# Altium schematic sheet Ampli_FI2.SchDoc
size A4
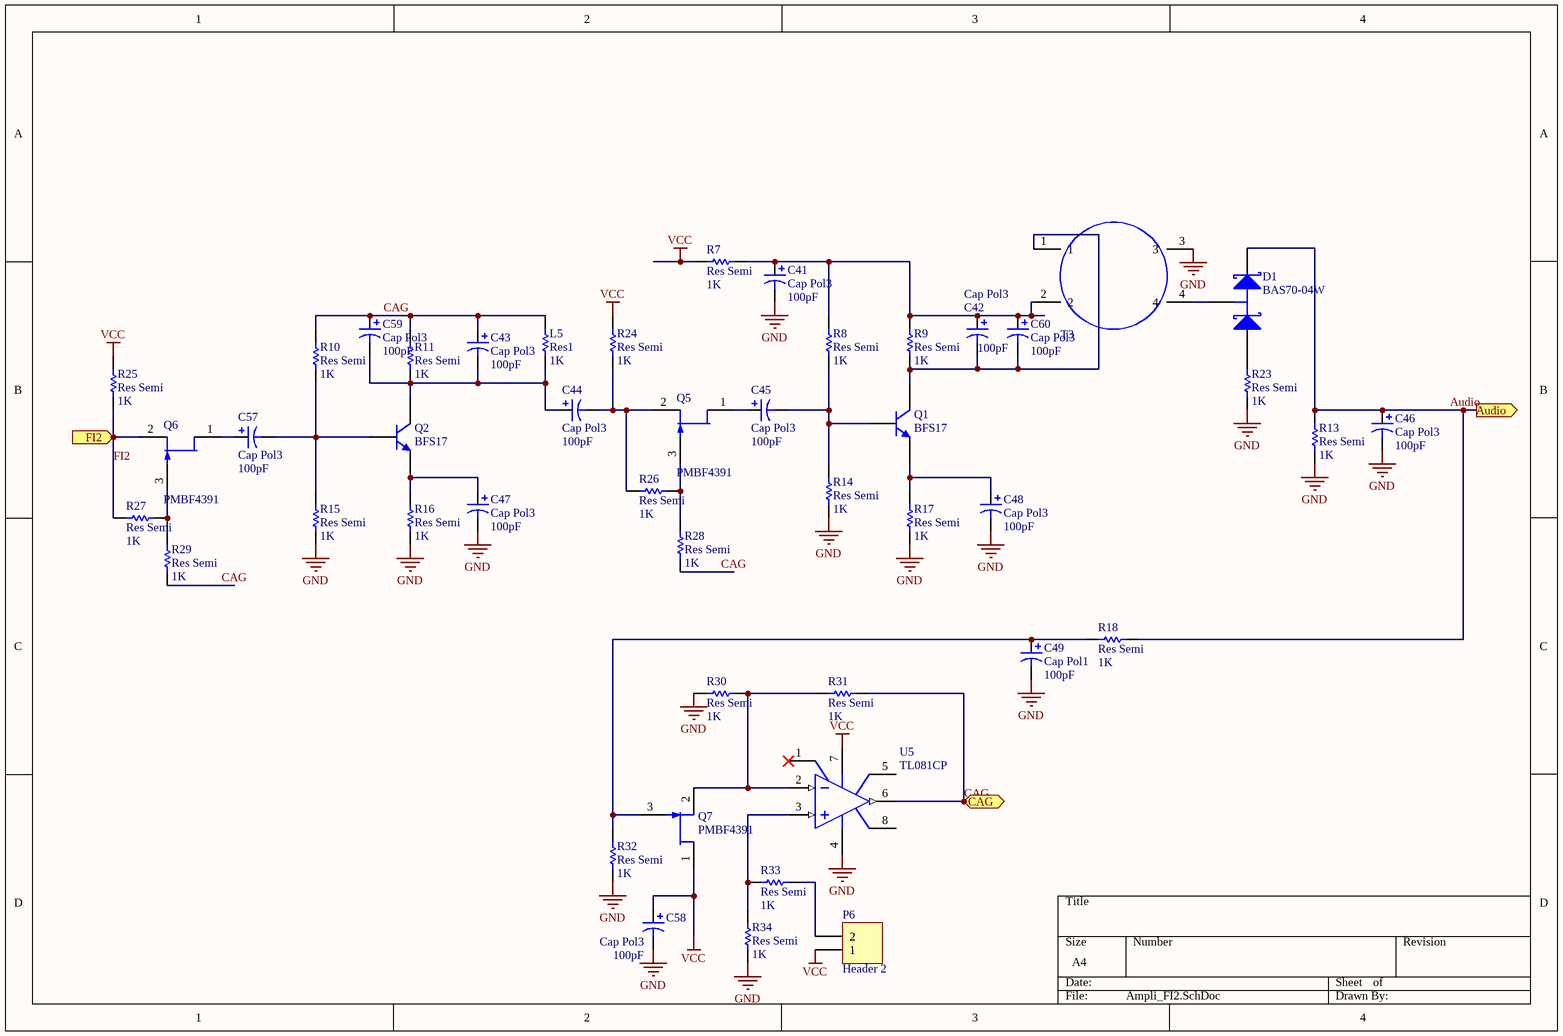
[diagram p0: Ampli_FI2.SchDoc]

## Parts
C41  Cap Pol3  value 100pF  [C0805]
C42  Cap Pol3  value 100pF  [C0805]
C43  Cap Pol3  value 100pF  [C0805]
C44  Cap Pol3  value 100pF  [C0805]
C45  Cap Pol3  value 100pF  [C0805]
C46  Cap Pol3  value 100pF  [C0805]
C47  Cap Pol3  value 100pF  [C0805]
C48  Cap Pol3  value 100pF  [C0805]
C49  Cap Pol1  value 100pF  [B]
C57  Cap Pol3  value 100pF  [C0805]
C58  Cap Pol3  value 100pF  [C0805]
C59  Cap Pol3  value 100pF  [C0805]
C60  Cap Pol3  value 100pF  [C0805]
D1  BAS70-04W  [SOT323_N]
L5  Res1  value 1K  [AXIAL-0.3]
P6  Header 2  [HDR1X2]
Q1  BFS17  [SOT23_N]
Q2  BFS17  [SOT23_N]
Q5  PMBF4391  [SOT23_N]
Q6  PMBF4391  [SOT23_N]
Q7  PMBF4391  [SOT23_N]
R7  Res Semi  value 1K  [2012[0805]]
R8  Res Semi  value 1K  [2012[0805]]
R9  Res Semi  value 1K  [2012[0805]]
R10  Res Semi  value 1K  [2012[0805]]
R11  Res Semi  value 1K  [2012[0805]]
R13  Res Semi  value 1K  [2012[0805]]
R14  Res Semi  value 1K  [2012[0805]]
R15  Res Semi  value 1K  [2012[0805]]
R16  Res Semi  value 1K  [2012[0805]]
R17  Res Semi  value 1K  [2012[0805]]
R18  Res Semi  value 1K  [2012[0805]]
R23  Res Semi  value 1K  [2012[0805]]
R24  Res Semi  value 1K  [2012[0805]]
R25  Res Semi  value 1K  [2012[0805]]
R26  Res Semi  value 1K  [2012[0805]]
R27  Res Semi  value 1K  [2012[0805]]
R28  Res Semi  value 1K  [2012[0805]]
R29  Res Semi  value 1K  [2012[0805]]
R30  Res Semi  value 1K  [2012[0805]]
R31  Res Semi  value 1K  [2012[0805]]
R32  Res Semi  value 1K  [2012[0805]]
R33  Res Semi  value 1K  [2012[0805]]
R34  Res Semi  value 1K  [2012[0805]]
T3  Toroide  [NTH12_4]  (value not drawn)
U5  TL081CP  [626-05]

## Ports
Audio (out), CAG (out), FI2 (in)

## Nets
GND: C41.2 C46.2 C47.2 C48.2 C49.2 C58.2 R13.1 R14.2 R15.1 R16.1 R17.2 R23.1 R30.1 R32.2 R34.2 T3.3 U5.4(V-)
VCC: C58.1 P6.1 Q7.1(D) R7.2 R24.2 R25.1 U5.7(V+)
Audio: C46.1 D1.2(K) R13.2 R18.1 ; port Audio
CAG: C43.1 C59.1 L5.2 R10.2 R11.2 R28.2 R29.2 R31.2 U5.6(OUT) ; port CAG
FI2: Q6.2(S) R25.2 R27.1 ; port FI2
NetC41_1: C41.1 C42.1 C60.1 R7.1 R8.1 R9.1 T3.2
NetC42_2: C42.2 C60.2 Q1.3(C) R9.2 T3.1
NetC43_2: C43.2 C44.1 C59.2 L5.1 Q2.3(C) R11.1
NetC44_2: C44.2 Q5.2(S) R24.1 R26.1
NetC45_1: C45.1 Q5.1(D)
NetC45_2: C45.2 Q1.1(B) R8.2 R14.1
NetC47_1: C47.1 Q2.2(E) R16.2
NetC48_1: C48.1 Q1.2(E) R17.1
NetC49_1: C49.1 Q7.3(G) R18.2 R32.1
NetC57_1: C57.1 Q6.1(D)
NetC57_2: C57.2 Q2.1(B) R10.1 R15.2
NetD1_1: D1.1(A) R23.2
NetD1_3: D1.3(C) T3.4
NetP6_2: P6.2 R33.1
NetQ5_3: Q5.3(G) R26.2 R28.1
NetQ6_3: Q6.3(G) R27.2 R29.1
NetQ7_2: Q7.2(S) R30.2 R31.1 U5.2(IN-)
NetR33_2: R33.2 R34.1 U5.3(IN+)

Not connected (* = marked no-connect by the designer): U5 1(OS_NULL)* 5(OS_NULL) 8(NC)

## Library data of the parts
C41-C48 C57-C60 = Cap Pol3: Polarized Capacitor (Surface Mount); Published: 8-Jun-2000; LatestRevisionDate: 17-Jul-2002; LatestRevisionNote: Re-released for DXP Platform.; PackageReference: C0805; Publisher: Altium Limited
C49 = Cap Pol1: Polarized Capacitor (Radial); Published: 8-Jun-2000; LatestRevisionDate: 17-Jul-2002; LatestRevisionNote: Re-released for DXP Platform.; PackageReference: RB7.6-15; Publisher: Altium Limited
D1 = BAS70-04W: Schottky Barrier Double Diode; Published: 17-Sep-2003; LatestRevisionDate: 12-Dec-2006; LatestRevisionNote: IPC-7351 Footprint Added.; DatasheetVersion: 26-Mar-1999; PackageVersion: Apr-1999; PackageReference: SOT323; Publisher: Altium Limited; PackageDescription: 3-Pin SOT-323 Package 0.65 mm Pitch, 2.1 mm Lead Span; ComponentLink1Description: Manufacturer Link; ComponentLink1URL: http://www.semiconductors.philips.com/; ComponentLink2Description: Datasheet; ComponentLink2URL: http://www.semiconductors.philips.com/acrobat/datasheets/BAS70W_3.pdf
L5 = Res1: Resistor; Published: 8-Jun-2000; LatestRevisionDate: 17-Jul-2002; LatestRevisionNote: Re-released for DXP Platform.; PackageReference: AXIAL-0.3; Publisher: Altium Limited
P6 = Header 2: Header, 2-Pin; LatestRevisionDate: 17-Jul-2002; LatestRevisionNote: Re-released for DXP Platform.; Publisher: Altium Limited
Q1 Q2 = BFS17: NPN 1 GHz Wideband Transistor; Published: 17-Sep-2003; LatestRevisionDate: 12-Dec-2006; LatestRevisionNote: IPC-7351 Footprint Added.; DatasheetVersion: Sep-1995; PackageVersion: May-1999; PackageReference: SOT23; Publisher: Altium Limited; PackageDescription: 3-Pin SOT-23 Package 0.95 mm Pitch, 2.3 mm Lead Span; ComponentLink1Description: Manufacturer Link; ComponentLink1URL: http://www.semiconductors.philips.com/; ComponentLink2Description: Datasheet; ComponentLink2URL: http://www.semiconductors.philips.com/acrobat/datasheets/BFS17_2.pdf
Q5-Q7 = PMBF4391: N-channel Silicon Junction Field-effect Transistor; Published: 17-Sep-2003; LatestRevisionDate: 12-Dec-2006; LatestRevisionNote: IPC-7351 Footprint Added.; DatasheetVersion: Apr-1995; PackageVersion: May-1999; PackageReference: SOT23; Publisher: Altium Limited; PackageDescription: 3-Pin SOT-23 Package 0.95 mm Pitch, 2.3 mm Lead Span; ComponentLink1Description: Manufacturer Link; ComponentLink1URL: http://www.semiconductors.philips.com/; ComponentLink2Description: Datasheet; ComponentLink2URL: http://www.semiconductors.philips.com/acrobat/datasheets/PMBF4391_4392_4393_CNV_2.pdf
R7-R11 R13-R18 R23-R34 = Res Semi: Semiconductor Resistor; Published: 8-Jun-2000; LatestRevisionDate: 17-Jul-2002; LatestRevisionNote: Re-released for DXP Platform.; PackageReference: AXIAL-0.5; Publisher: Altium Limited
T3 = Transformador_Toroide
U5 = TL081CP: JFET-Input Operational Amplifier; Published: 17-Jul-2002; LatestRevisionDate: 06-Jun-2005; LatestRevisionNote: Stylized 3D Model Added.; DatasheetVersion: 1988; PackageReference: 626-05; Publisher: Altium Limited; PackageDescription: DIP; 8 Leads; Row Spacing 7.62 mm; Pitch 2.54 mm; ComponentLink1Description: Manufacturer Link; ComponentLink1URL: http://www.onsemi.com/site/products/parametrics/0,4446,251,00.html